# EAGLE design Arduino DUE Shield (EAGLE 6.5.0)
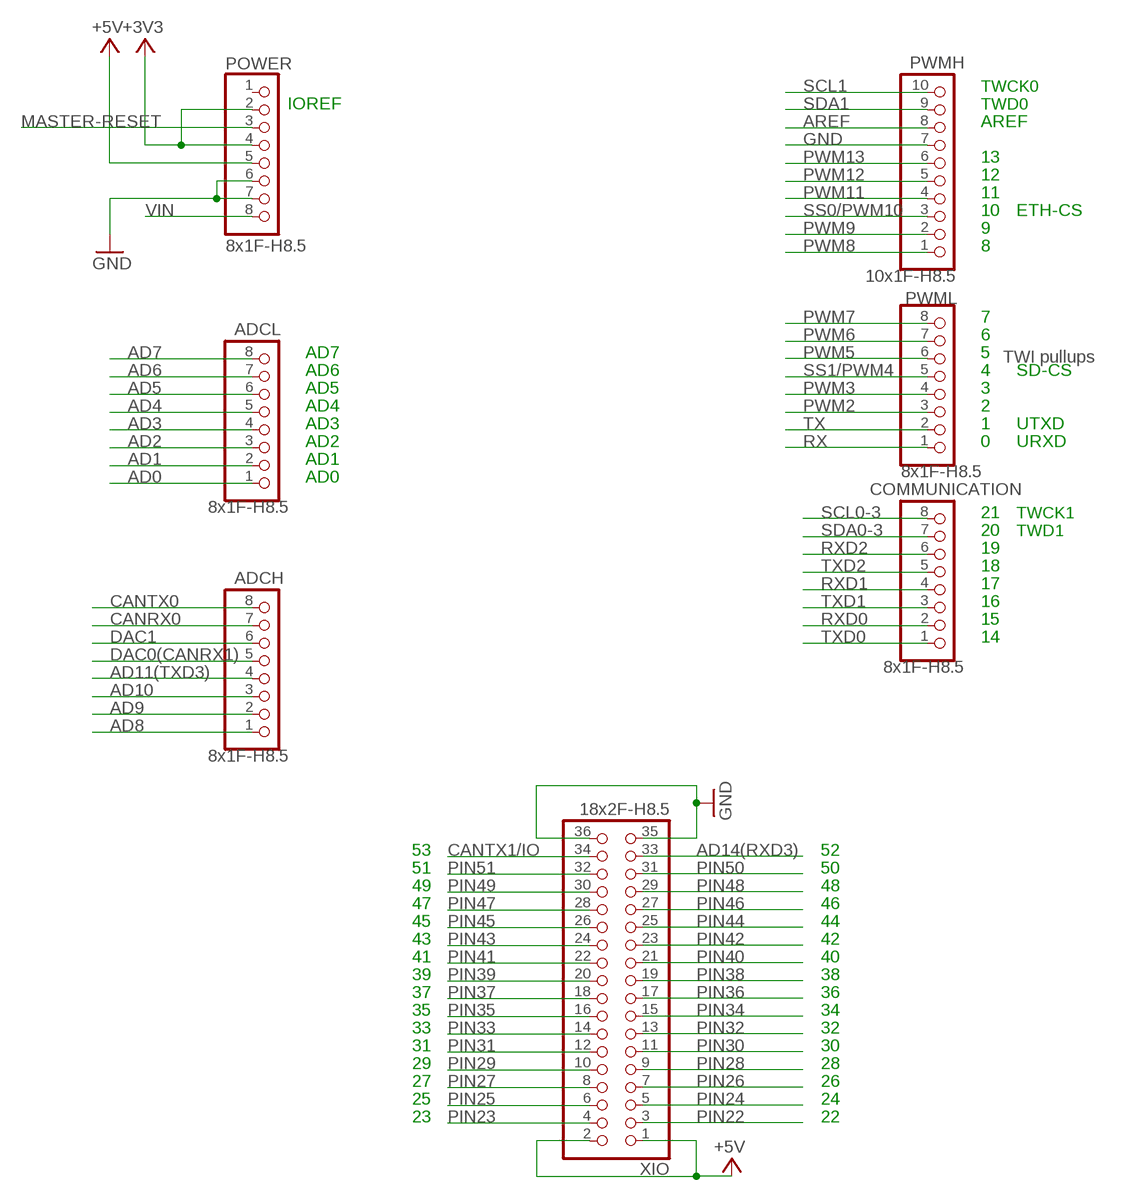
[diagram p0: schematic, sheet 1]

## Parts
ADCH  8x1F-H8.5  PINHD-1X8  [1X08]
ADCL  8x1F-H8.5  PINHD-1X8  [1X08]
COMMUNICATION  8x1F-H8.5  PINHD-1X8  [1X08]
POWER  8x1F-H8.5  PINHD-1X8  [1X08]
PWMH  10x1F-H8.5  PINHD-1X10  [1X10]
PWML  8x1F-H8.5  PINHD-1X8  [1X08]
XIO  18x2F-H8.5  PINHD-2X18  [2X18]

## Nets
+3V3: POWER.2 POWER.4
+5V: POWER.5 XIO.1 XIO.2
AD0: ADCL.1
AD1: ADCL.2
AD2: ADCL.3
AD3: ADCL.4
AD4: ADCL.5
AD5: ADCL.6
AD6: ADCL.7
AD7: ADCL.8
AD8: ADCH.1
AD9: ADCH.2
AD10: ADCH.3
AD11(TXD3): ADCH.4
AD14(RXD3): XIO.33
AREF: PWMH.8
CANRX0: ADCH.7
CANTX0: ADCH.8
CANTX1/IO: XIO.34
DAC0(CANRX1): ADCH.5
DAC1: ADCH.6
GND: POWER.6 POWER.7 PWMH.7 XIO.35 XIO.36
MASTER-RESET: POWER.3
PIN22: XIO.3
PIN23: XIO.4
PIN24: XIO.5
PIN25: XIO.6
PIN26: XIO.7
PIN27: XIO.8
PIN28: XIO.9
PIN29: XIO.10
PIN30: XIO.11
PIN31: XIO.12
PIN32: XIO.13
PIN33: XIO.14
PIN34: XIO.15
PIN35: XIO.16
PIN36: XIO.17
PIN37: XIO.18
PIN38: XIO.19
PIN39: XIO.20
PIN40: XIO.21
PIN41: XIO.22
PIN42: XIO.23
PIN43: XIO.24
PIN44: XIO.25
PIN45: XIO.26
PIN46: XIO.27
PIN47: XIO.28
PIN48: XIO.29
PIN49: XIO.30
PIN50: XIO.31
PIN51: XIO.32
PWM2: PWML.3
PWM3: PWML.4
PWM5: PWML.6
PWM6: PWML.7
PWM7: PWML.8
PWM8: PWMH.1
PWM9: PWMH.2
PWM11: PWMH.4
PWM12: PWMH.5
PWM13: PWMH.6
RX: PWML.1
RXD0: COMMUNICATION.2
RXD1: COMMUNICATION.4
RXD2: COMMUNICATION.6
SCL0-3: COMMUNICATION.8
SCL1: PWMH.10
SDA0-3: COMMUNICATION.7
SDA1: PWMH.9
SS0/PWM10: PWMH.3
SS1/PWM4: PWML.5
TX: PWML.2
TXD0: COMMUNICATION.1
TXD1: COMMUNICATION.3
TXD2: COMMUNICATION.5
VIN: POWER.8
Unconnected: POWER.1

## Notes on the sheet
- TWCK0
- IOREF | TWD0
- AREF
- 13
- 12
- 11
- 10 | ETH-CS
- 9
- 8
- 7
- 6
- AD7 | 5 | TWI pullups
- AD6 | 4 | SD-CS
- AD5 | 3
- AD4 | 2
- AD3 | 1 | UTXD
- AD2 | 0 | URXD
- AD1
- AD0
- 21 | TWCK1
- 20 | TWD1
- 19
- 18
- 17
- 16
- 15
- 14
- 53 | 52
- 51 | 50
- 49 | 48
- 47 | 46
- 45 | 44
- 43 | 42
- 41 | 40
- 39 | 38
- 37 | 36
- 35 | 34
- 33 | 32
- 31 | 30
- 29 | 28
- 27 | 26
- 25 | 24
- 23 | 22

## Library data of the parts
ADCH ADCL COMMUNICATION POWER PWML = SmartPrj:PINHD-1X8: PIN HEADER
PWMH = SmartPrj:PINHD-1X10: PIN HEADER
XIO = SmartPrj:PINHD-2X18: PIN HEADER

## Net classes
0 default: width 0.203 mm, drill 0.305 mm, clearance 0.203 mm
1 USB: drill 0.406 mm, clearance 0.203 mm to class 0, clearance 0.406 mm
2 gnd: width 0.305 mm, drill 0.406 mm, clearance 0.203 mm to class 0, clearance 0.203 mm
3 usbvcc: width 0.61 mm, drill 0.508 mm, clearance 0.203 mm to class 0, clearance 0.254 mm

## Board
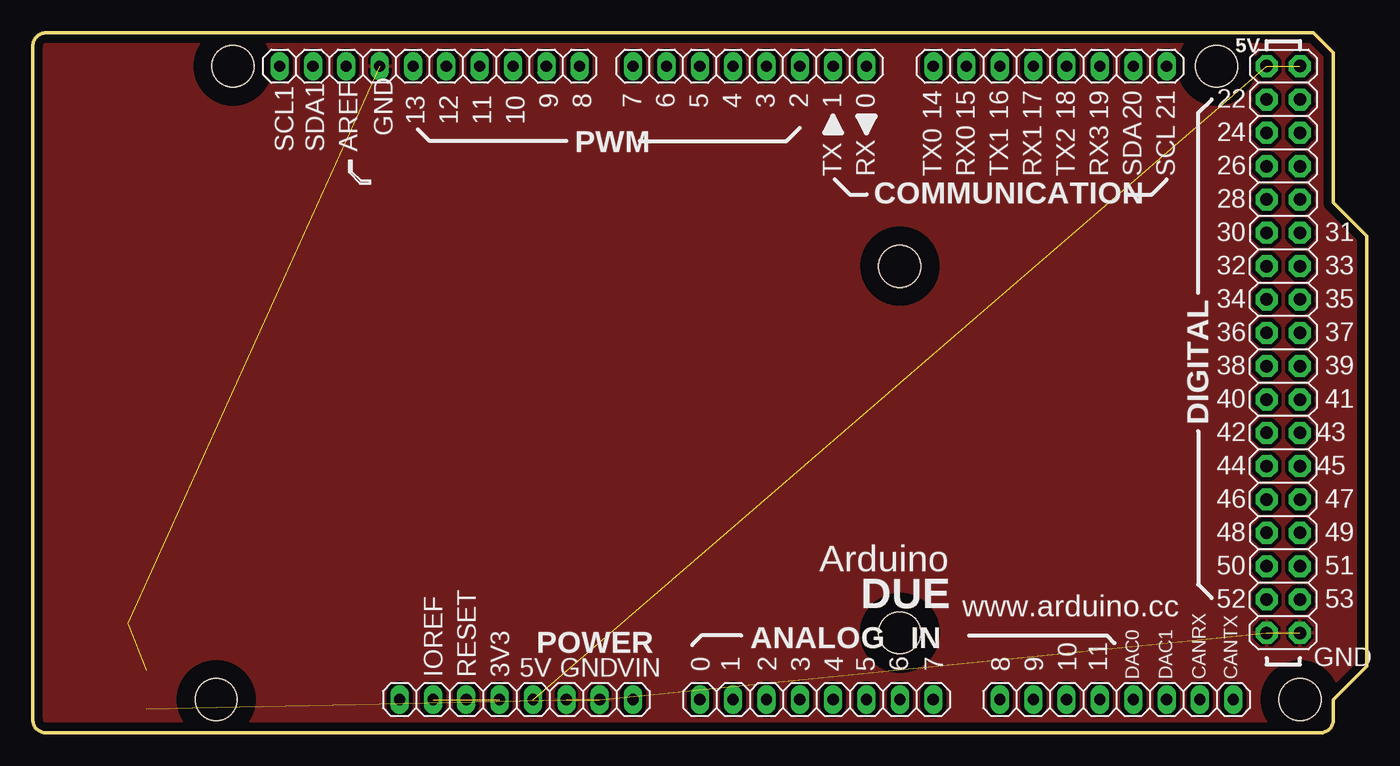
[diagram p1: board, top side]
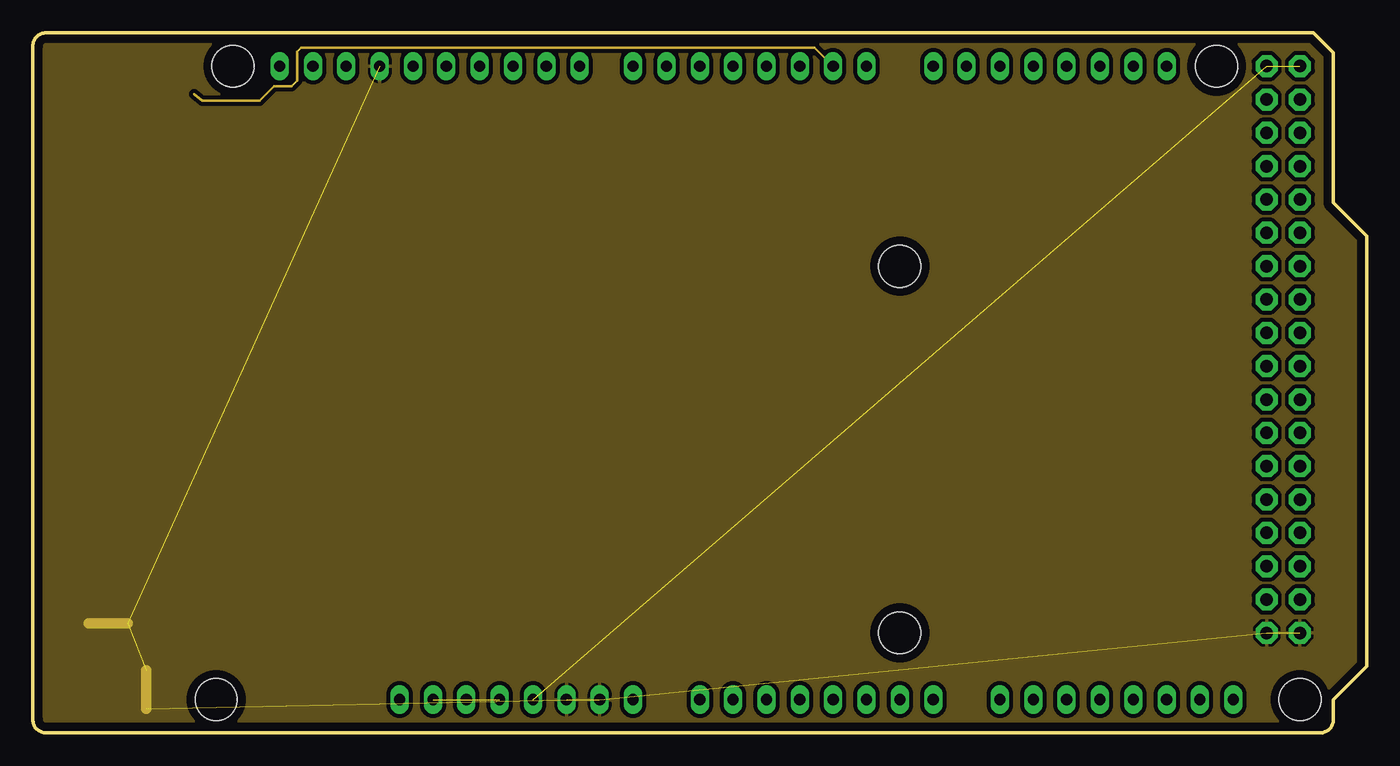
[diagram p2: board, inner layer Route2]
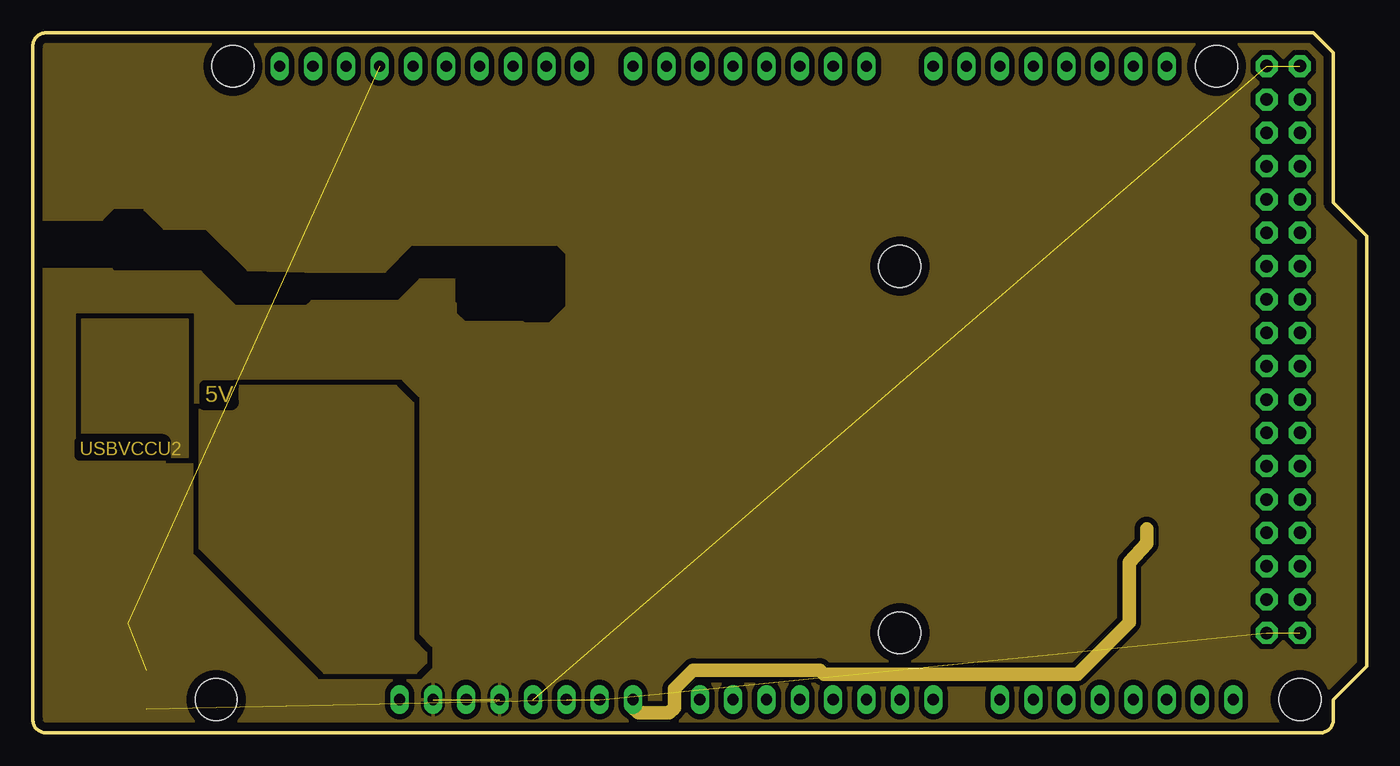
[diagram p3: board, inner layer Route15]
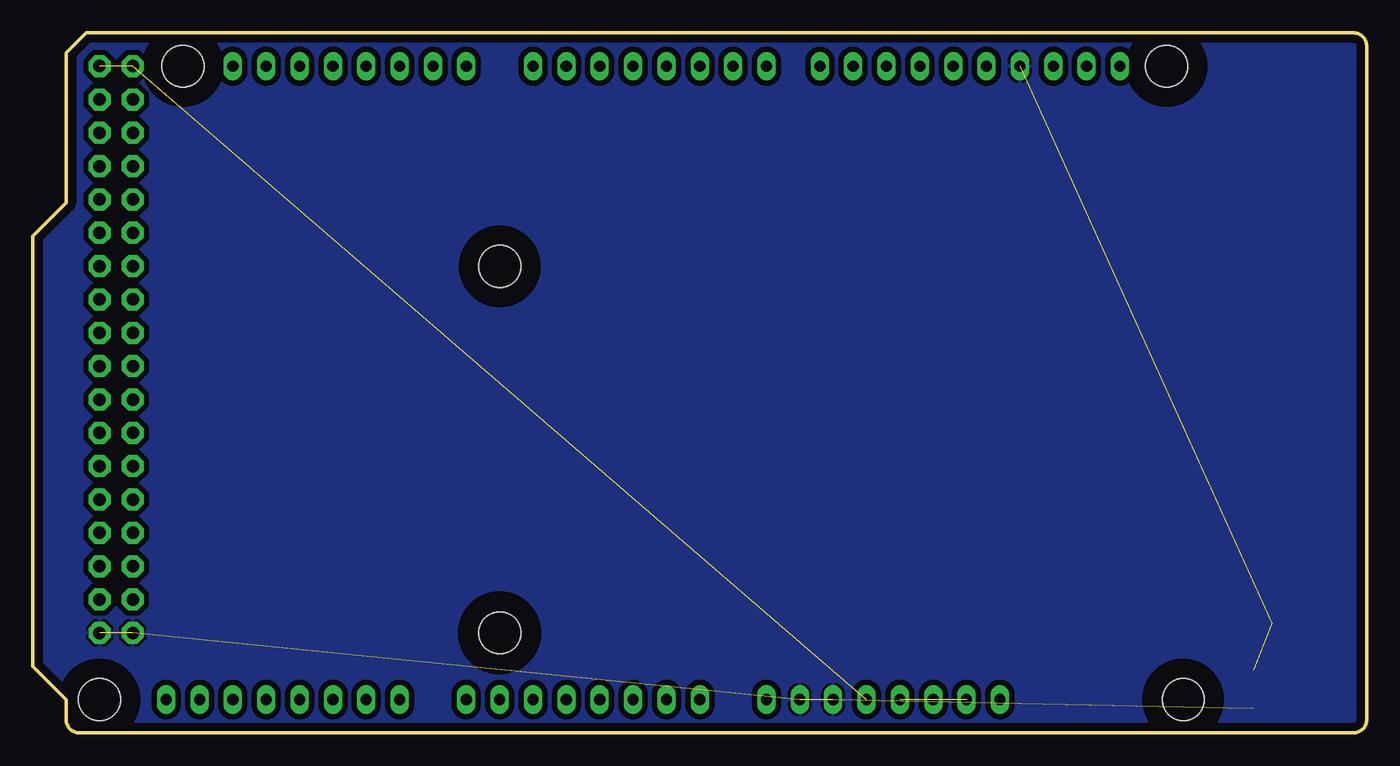
[diagram p4: board, bottom side, seen from below]

Size 101.6 x 53.34 mm. Coordinates in mm from the lower left corner, seen from the top.
Outline: 97.54,53.34 99.06,51.82 99.06,40.39 101.6,37.85 101.6,5.08 99.06,2.54 99.06,1 arc-90 98.06,0 1,0 arc-90 0,1 0,52.34 arc-90 1,53.34 97.54,53.34
Copper layers (1*2*15*16): Top 0.035mm / dielectric 0.2mm / Route2 0.035mm / dielectric 1mm / Route15 0.035mm / dielectric 0.2mm / Bottom 0.035mm
Design rules "default": minimum track width 8mil, minimum drill 16mil, track to track 8mil, track to pad 8mil, pad to pad 6mil, via to via 8mil, smd to smd 6mil, copper to edge 25mil, drill to drill 12mil, minimum pad ring 8mil, minimum via ring 8mil, stop-mask expansion 2mil, vias tented up to drill 25mil, thermal gap 8mil
Holes 3.2 mm at 96.52,2.54 15.24,50.8 90.17,50.8 13.97,2.54 66.04,35.56 66.04,7.62
tRestrict: area 63.5,5.1 to 68.6,10.2; area 12.7,48.3 to 17.8,53.3; area 63.5,33 to 68.6,38.1; area 87.6,48.3 to 92.7,53.3; area 94,0 to 99.1,5.1; area 11.4,0 to 16.5,5.1
bRestrict: area 63.5,5.1 to 68.6,10.2; area 12.7,48.3 to 17.8,53.3; area 63.5,33 to 68.6,38.1; area 87.6,48.3 to 92.7,53.3; area 94,0 to 99.1,5.1; area 11.4,0 to 16.5,5.1

### Footprints (pad centres in the part's own frame; a part is rotated, then mirrored left to right if it is on the bottom)
1X08 = drill 0.85 pad 1.422 long: 1 -8.89,0; 2 -6.35,0; 3 -3.81,0; 4 -1.27,0; 5 1.27,0; 6 3.81,0; 7 6.35,0; 8 8.89,0
1X10 = drill 0.85 pad 1.422 long: 1 -11.43,0; 2 -8.89,0; 3 -6.35,0; 4 -3.81,0; 5 -1.27,0; 6 1.27,0; 7 3.81,0; 8 6.35,0; 9 8.89,0; 10 11.43,0
2X18 = drill 0.95 pad 1.676 octagon: 1 -21.59,-1.27; 2 -21.59,1.27; 3 -19.05,-1.27; 4 -19.05,1.27; 5 -16.51,-1.27; 6 -16.51,1.27; 7 -13.97,-1.27; 8 -13.97,1.27; 9 -11.43,-1.27; 10 -11.43,1.27; 11 -8.89,-1.27; 12 -8.89,1.27; 13 -6.35,-1.27; 14 -6.35,1.27; 15 -3.81,-1.27; 16 -3.81,1.27; 17 -1.27,-1.27; 18 -1.27,1.27; 19 1.27,-1.27; 20 1.27,1.27; 21 3.81,-1.27; 22 3.81,1.27; 23 6.35,-1.27; 24 6.35,1.27; 25 8.89,-1.27; 26 8.89,1.27; 27 11.43,-1.27; 28 11.43,1.27; 29 13.97,-1.27; 30 13.97,1.27; 31 16.51,-1.27; 32 16.51,1.27; 33 19.05,-1.27; 34 19.05,1.27; 35 21.59,-1.27; 36 21.59,1.27

### Placement (x,y rotation side)
ADCH  82.55,2.54 0 top
ADCL  59.69,2.54 0 top
COMMUNICATION  77.47,50.8 0 top
POWER  36.83,2.54 0 top
PWMH  30.23,50.8 180 top
PWML  54.61,50.8 180 top
XIO  95.25,29.21 270 top

### Tracks (layer width: path | path; a pad name or v marks a point on that pad's centre or on a via)
+3V3  (1 unrouted)
  pour Route15 (isolate 0.406, rank 2): 101.63,53.31 101.42,-0.08 -0.25,-0.08 0,35.36 5.99,35.36 6.2,35.15 12.8,35.15 15.44,32.51 20.83,32.51 21.23,32.92 27.84,32.92 29.46,34.54 32.11,34.54 32.11,32.82 32.21,32.72 32.21,32 32.92,31.29 37.29,31.29 37.39,31.19 39.32,31.19 40.64,32.51 40.64,36.47 39.93,37.19 28.85,37.19 26.82,35.15 20.73,35.15 16.36,35.26 13.15,38.4 9.96,38.4 8.53,39.83 8.53,40.03 6.2,40.03 5.28,39.12 -0.1,39.12 -0.25,51.6 arc-90 1.43,53.21
+5V  (2 unrouted)
  pour Route15 (isolate 0.61): 29.21,4.57 22.19,4.57 12.7,14.06 12.7,26.16 12.95,26.42 27.69,26.42 28.96,25.15 28.96,7.11 29.97,6.1 29.97,5.33
GND  (6 unrouted)
  Route2 0.813: 4.27,8.33 7.21,8.33 | 8.64,1.83 8.64,4.78
  pour Top (isolate 0.305, rank 2): 101.83,53.42 101.63,0.03 -0.05,0.03 -0.05,51.7 arc-90 1.64,53.31
  pour Bottom (isolate 0.406, rank 2): 1.64,53.42 102.06,53.42 102.06,0 -0.3,-0.03 -0.41,51.27 arc-90
  pour Route2 (isolate 0.305, rank 2): 101.73,53.42 101.52,0.03 -0.15,0.03 0.1,35.46 0,39.22 -0.15,51.7 arc-90 1.53,53.31
TX
  Route2 0.203: PWML.2 59.54,52.22 20.42,52.22 20.12,51.92 20.12,49.68 19.71,49.28 18.39,49.28 17.27,48.16 12.9,48.16 12.29,48.67
USBVCCU2
  pour Route15 (isolate 0.61): 3.76,31.5 3.76,21.03 11.79,21.03 11.79,31.5
VIN
  Route15 1.016: POWER.8 45.72,1.93 46.13,1.52 48.46,1.52 48.87,1.93 48.87,3.35 50.29,4.78 59.94,4.78 60.25,4.47 79.55,4.47 83.52,8.43 83.52,13.01 84.84,14.43 84.84,15.54

### Text on the board
Route15: 5V | USBVCCU2
tPlace: 9 | 8 | 7 | 6 | 5 | 4 | 3 | 2 | 1 | 0 | 22 | 14 | 15 | 16 | 17 | 18 | 19 | 20 | 21 | 13 | 12 | 11 | 10 | 24 | 26 | 28 | 30 | 31 | 32 | 33 | 34 | 35 | 36 | 37 | 38 | 39 | 40 | 41 | 42 | 43 | 44 | 45 | 46 | 47 | 48 | 49 | 50 | 51 | 52 | 53 | www.arduino.cc | 0 | 1 | 2 | 3 | 4 | 5 | 6 | 7 | 8 | 9 | 10 | 11 | DAC0 | DAC1 | CANRX | CANTX
tNames: 5V | GND | SCL1 | SDA1 | AREF | PWM | TX | RX | TX0 | RX0 | TX1 | RX1 | TX2 | RX3 | SDA | SCL | DIGITAL | Arduino | DUE | ANALOG IN | GND | IOREF | RESET | 3V3 | 5V | GND | VIN